# Altium schematic sheet pcbSchematic.SchDoc
size A; SheetNumber: 1; SheetTotal: 1
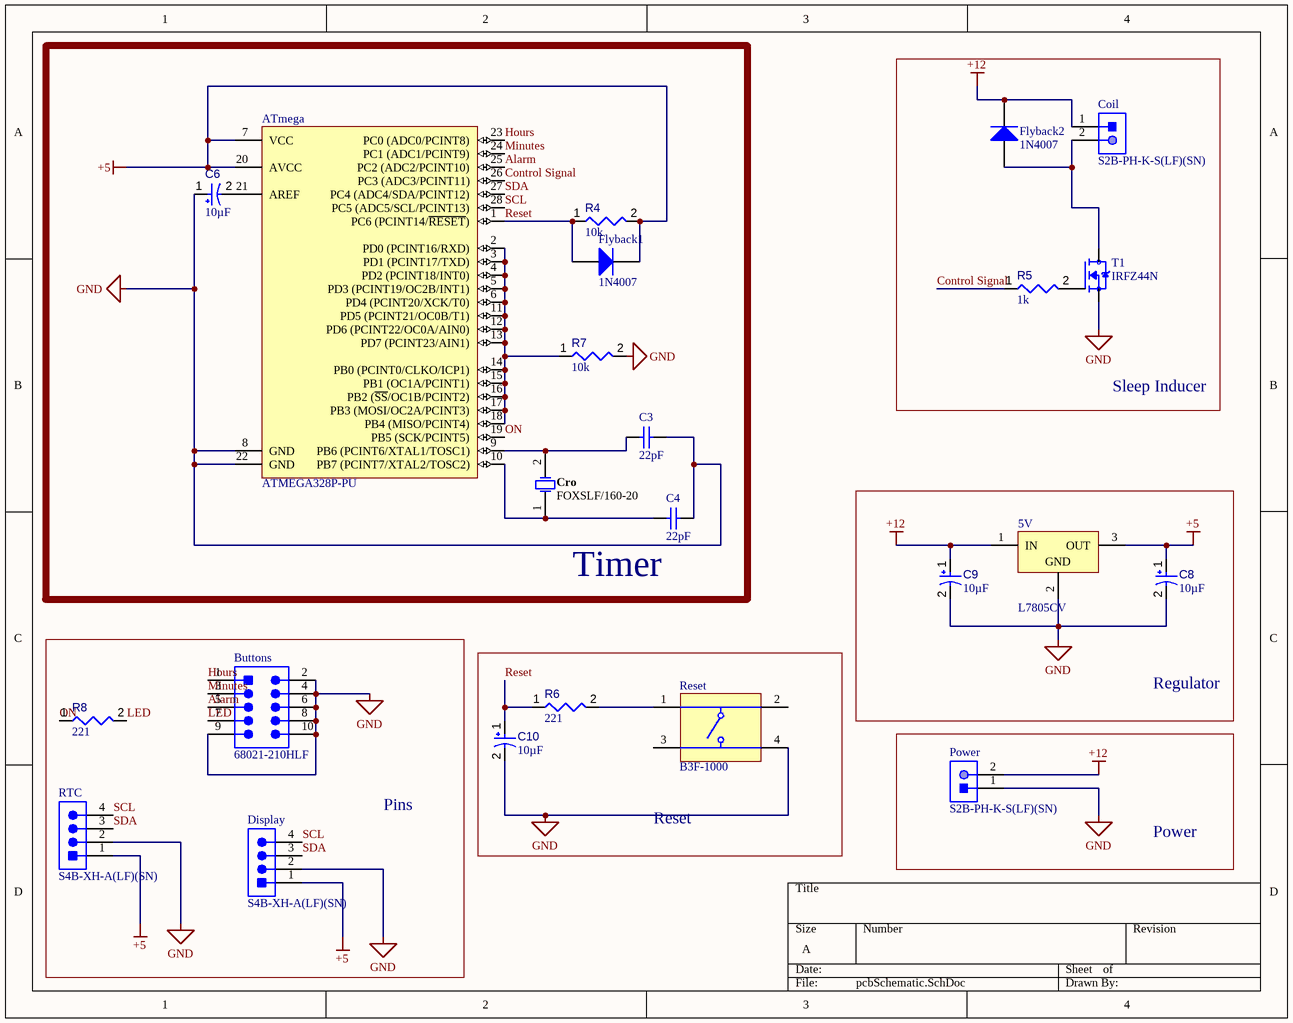
[diagram p0: pcbSchematic.SchDoc]

## Parts
5V  L7805CV  [TO220]
ATmega  ATMEGA328P-PU  [ATML-28P3]
Buttons  68021-210HLF  [FCI-68021-210HLF-10_V]
C3  22pF  [KEMT-C315-THT-2]
C4  22pF  [KEMT-C315-THT-2]
C6  value 10µF  [CAPPR55-200-1100X500X1200]  (hidden comment: ECA1HM100)
C8  value 10µF  [CAPPR55-200-1100X500X1200]  (hidden comment: ECA1HM100)
C9  value 10µF  [CAPPR55-200-1100X500X1200]  (hidden comment: ECA1HM100)
C10  value 10µF  [CAPPR55-200-1100X500X1200]  (hidden comment: ECA1HM100)
Coil  S2B-PH-K-S(LF)(SN)  [JST-S2B-PH-K-S_V]
Cro  FOXSLF/160-20  [FOX-FOXSLF160-20]
Display  S4B-XH-A(LF)(SN)  [JST-S4B-XH-A(LF)(SN)_V]
Flyback1  1N4007  [FAIR-DO-41-2]
Flyback2  1N4007  [FAIR-DO-41-2]
Power  S2B-PH-K-S(LF)(SN)  [JST-S2B-PH-K-S_V]
R4  value 10k  [RESA60-630X240]  (hidden comment: MFR-25FBF52-10K)
R5  value 1k  [RESA60-630X240]  (hidden comment: MFR-25FBF52-1K)
R6  value 221  [RESA60-630X240]  (hidden comment: MFR-25FBF52-221R)
R7  value 10k  [RESA60-630X240]  (hidden comment: MFR-25FBF52-10K)
R8  value 221  [RESA60-630X240]  (hidden comment: MFR-25FBF52-221R)
Reset  B3F-1000  [OMRON-B3F-1000-4_V]
RTC  S4B-XH-A(LF)(SN)  [JST-S4B-XH-A(LF)(SN)_V]
T1  IRFZ44N  [TO254P1016X419X2286-3]

## Blocks framed on the sheet
Timer: ATmega C3 C4 C6 Cro Flyback1 R4 R7
Sleep Inducer: Coil Flyback2 R5 T1
Regulator: 5V C8 C9
Pins: Buttons Display R8 RTC
Reset: C10 R6 Reset
Power: Power

## Nets
+5: 5V.3(OUT) ATmega.7(VCC) ATmega.20(AVCC) C8.1 Display.1 Flyback1.1(K) R4.2 RTC.1
+12: 5V.1(IN) C9.1 Coil.1 Flyback2.1(K) Power.2
GND: 5V.2(GND) ATmega.8(GND) ATmega.22(GND) Buttons.2 Buttons.4 Buttons.6 Buttons.8 Buttons.9 Buttons.10 C3.2 C4.2 C6.1 C8.2 C9.2 C10.2 Display.2 Power.1 R7.2 Reset.4 RTC.2 T1.3(S)
Alarm: ATmega.25(PC2_(ADC2/PCINT10)) Buttons.5
Control Signal: ATmega.26(PC3_(ADC3/PCINT11)) R5.1
Hours: ATmega.23(PC0_(ADC0/PCINT8)) Buttons.1
LED: Buttons.7 R8.2
Minutes: ATmega.24(PC1_(ADC1/PCINT9)) Buttons.3
ON: ATmega.19(PB5_(SCK/PCINT5)) R8.1
Reset: ATmega.1(PC6_(PCINT14/~{RESET})) C10.1 Flyback1.2(A) R4.1 R6.1
SCL: ATmega.28(PC5_(ADC5/SCL/PCINT13)) Display.4 RTC.4
SDA: ATmega.27(PC4_(ADC4/SDA/PCINT12)) Display.3 RTC.3
NetATmega_2: ATmega.2(PD0_(PCINT16/RXD)) ATmega.3(PD1_(PCINT17/TXD)) ATmega.4(PD2_(PCINT18/INT0)) ATmega.5(PD3_(PCINT19/OC2B/INT1)) ATmega.6(PD4_(PCINT20/XCK/T0)) ATmega.11(PD5_(PCINT21/OC0B/T1)) ATmega.12(PD6_(PCINT22/OC0A/AIN0)) ATmega.13(PD7_(PCINT23/AIN1)) ATmega.14(PB0_(PCINT0/CLKO/ICP1)) ATmega.15(PB1_(OC1A/PCINT1)) ATmega.16(PB2_(~{SS}/OC1B/PCINT2)) ATmega.17(PB3_(MOSI/OC2A/PCINT3)) ATmega.18(PB4_(MISO/PCINT4)) R7.1
NetATmega_9: ATmega.9(PB6_(PCINT6/XTAL1/TOSC1)) C3.1 Cro.2
NetATmega_10: ATmega.10(PB7_(PCINT7/XTAL2/TOSC2)) C4.1 Cro.1
NetATmega_21: ATmega.21(AREF) C6.2
NetCoil_2: Coil.2 Flyback2.2(A) T1.2(D)
NetR5_2: R5.2 T1.1(G)
NetR6_2: R6.2 Reset.1

Not connected (* = marked no-connect by the designer): Reset 2 3

## Library data of the parts
5V = CMP-019-00018-3: Positive Voltage Regulator IC, 1.5 A, 5 V, 0 to 125 degC, 3-Pin TO-220, RoHS, Tube; Manufacturer: STMicroelectronics; Max Input Voltage: 35V; Min Supply Voltage: 8V; Nominal Output Voltage: 5V; Outputs: 1; Output Current: 1.5A; Dropout Voltage: 2V; Max Supply Voltage: 20V; Min Input Voltage: 7V; Datasheet Version: Rev 30, 09/2012; Min Operating Temperature: 0°C; Manufacturer URL: http://www.st.com/; Pins: 3; Mounting Technology: TH; Output Voltage: 5V; RoHS Compliant: True; Max Ouput Current: 1.5A; Datasheet URL: https://datasheet.ciiva.com/15111/getdatasheetpartid-44136-15111027.pdf; Packaging: Rail/Tube; Max Operating Temperature: 125°C; Case/Package: TO-220; Package Quantity: 50
ATmega = CMP-020-00004-3: 8-Bit Microcontroller with 32 KBytes In-System Programmable Flash, 23 I/Os, -40 to 85 degC, 28-Pin PDIP (28P3), RoHS, Tube; Manufacturer: Atmel; I/Os: 23; Density: 32KB; Package Version: Rev. B, 09/2001; Max Clock Frequency: 20MHz; Interface: USART; Max Supply Voltage: 5.5V; Min Supply Voltage: 1.8V; Ethernet Channels: 0; RAM Size: 2KB; RoHS Compliant: True; Datasheet URL: http://www.atmel.com/images/Atmel-8271-8-bit-AVR-Microcontroller-ATmega48A-48PA-88A-88PA-168A-168PA-328-328P_datasheet_Complete.pdf; Packaging: Rail/Tube; Manufacturer URL: http://www.atmel.com/; Mounting Technology: TH; Package URL: http://www.atmel.com/images/Atmel-8271-8-bit-AVR-Microcontroller-ATmega48A-48PA-88A-88PA-168A-168PA-328-328P_datasheet_Complete.pdf; Datasheet Version: Rev. 8271J, 11/2015; Package Description: 28-Pin Plastic Dual Inline Package, Body 34.671 x 7.3025 mm, Pitch 2.54 mm; Package Quantity: 14; Min Operating Temperature: -40°C; Max Operating Temperature: 85°C; Case/Package: DIP; Pins: 28; Package Reference: 28P3
Buttons = CMP-002-00020-2: Male Header, Pitch 2.54 mm, 2 x 5 Position, Height 4.83 mm, Tail Length 3.05 mm, Bulk; Manufacturer: FCI Electronics; Datasheet URL: http://portal.fciconnect.com/Comergent//fci/drawing/68020.pdf; Case/Package: 68021-210HLF-10; Manufacturer URL: http://portal.fciconnect.com/; Connector Type: Header; Mounting Technology: TH; Datasheet Version: Rev. BM, 04/2015; Package Description: Male Header, Pitch 2.54 mm, 2 x 5 Position, Height 4.83 mm, Tail Length 3.05 mm; Gender: Male; RoHS Compliant: Unknown; Package Reference: 68021-210HLF-10
C3 C4 = CMP-1664-00008-1: Capacitor, Ceramic, 22 pF, +/-10 %, 100 V, -55 to 125 degC, 2-Pin THD, RoHS, Bulk; Max Input Voltage: 40 V; Min Input Voltage: 4.2 V; Output Current: 1.5 A; Output Voltage: 1.2 V; Outputs: 1; Case\Package: TO-220; RoHSCompliant: true; Min Operating Temperature: 0 degC; Max Operating Temperature: 125 degC; Package Quantity: 50; ComponentLink2URL: http://capacitoredge.kemet.com/capedge2/DataSheet/Datasheet-C315C220K1G5TA.pdf?pn=C315C220K1G5TA{BULK}; Radiation Hardening: No; Pins: 3; Length: 10.28 mm; ComponentLink1URL: http://www.kemet.com/; ComponentLink2Description: Datasheet; Height: 9.28 mm; REACH SVHC: No SVHC; ComponentLink1Description: Manufacturer URL; Max Ouput Current: 1.5 A; Weight: 0.08113 oz; Packaging: Rail/Tube; DatasheetVersion: Aug-16; Mount: Through Hole; PackageReference: C315-THT-2; Width: 4.82 mm; PackageDescription: 2-Pin Through Hole Device, Body 3.81 x 2.54 mm
C6 C8-C10 = CMP-001-00025-7: Aluminum Electrolytic Capacitor, 10 uF, +/- 20%, 50 V, -40 to 85 degC, 2-Pin THD, RoHS, Bulk; Manufacturer: Panasonic; Ripple Current (AC): 65mA; Voltage Rating: 50V; Mounting Technology: TH; RoHS Compliant: True; Capacitor Type: Electrolytic; Datasheet Version: Rev. 05, 10/2016; Min Operating Temperature: -40°C; Packaging: Bulk; Ripple Current: 65mA; Tolerance: 20%; Max Operating Temperature: 85°C; Datasheet URL: https://industrial.panasonic.com/cdbs/www-data/pdf/RDF0000/ABA0000C1218.pdf; Lead Pitch: 2mm; Pins: 2; Diameter: 5mm; Manufacturer URL: http://www.panasonic.com/; Package Reference: CAPPR55-200-1100X500X1200; Package Description: 2-Pin Radial Lead, Dia 5 mm, Height 12 mm; Case/Package: Radial; Package Quantity: 200
Coil Power = CMP-002-00030-2: Male Header, Pitch 2 mm, 1 x 2 Position, Height 4.8 mm, Tail Length 3.4 mm, -25 to 85 degC, RoHS, Bulk; Manufacturer: Japan Solderless Terminals; Package Reference: S2B-PH-K-S; Case/Package: S2B-PH-K-S; Datasheet URL: http://www.jst-mfg.com/product/pdf/eng/ePH.pdf; RoHS Compliant: Unknown; Datasheet Version: Dec-12; Gender: Male; Min Operating Temperature: -25°C; Max Operating Temperature: 85°C; Package Description: Male Header, Pitch 2 mm, 1 x 2 Position, Height 4.8 mm, Tail Length 3.4 mm; Connector Type: Header; Mounting Technology: SM
Cro = CMP-003-00027-2: Resistance Weld Thru-Hole Crystal, 16 MHz, +/- 30 ppm, 20 pF, -20 to 70 degC, 2-Pin THD, RoHS, Bulk; Manufacturer: FOX Electronics; Load Capacitance: 20pF; Resistance: 40Ohm; ESR: 40; Tolerance: 50ppm; Frequency Tolerance: 30ppm; Frequency: 16MHz; Datasheet URL: http://www.foxonline.com/pdfs/hc49slf.pdf; Packaging: Bulk; Min Operating Temperature: -20°C; Max Operating Temperature: 70°C; Mounting Technology: TH; RoHS Compliant: True; Datasheet Version: Mar-15; Manufacturer URL: http://www.foxonline.com/; Package Description: 2-Pin Through Hole Device, Body 11.35 x 4.65 mm; Pins: 2; Package Quantity: 100; Case/Package: FOXSLF160-20; Package Reference: FOXSLF160-20
Display RTC = CMP-002-00034-2: Male Header, Pitch 2.5 mm, 1 x 4 Position, Height 6.1 mm, Tail Length 3.4 mm, -25 to 85 degC, RoHS, Bulk; Manufacturer: JST; Manufacturer URL: http://www.jst.com/home2.html; RoHS Compliant: Unknown; Gender: Male; Min Operating Temperature: -25°C; Datasheet URL: http://www.jst-mfg.com/product/pdf/eng/eXH.pdf; Case/Package: S4B-XH-A(LF)(SN); Datasheet Version: May-16; Mounting Technology: TH; Package Reference: S4B-XH-A(LF)(SN); Max Operating Temperature: 85°C; Package Description: XH Series Disconnectable Crimp Style Connector, Pitch 2.5 mm, 1 x 4 Position, Height 6.1 mm, Tail Length 3.4 mm; Connector Type: Header
Flyback1 Flyback2 = CMP-004-00007-2: General Purpose Rectifier, 1.1 V, 1.0 A, -55 to 175 degC, 2-Pin DO-41, RoHS, Tape and Reel; Manufacturer: Fairchild; Peak Reverse Current: 5uA; Max Surge Current: 30A; Elements: 1; Forward Voltage: 1.1V; Package Version: Rev. 2, 09/2008; Forward Current: 1A; Package Quantity: 5000; Packaging: TapeandReel; Package URL: http://www.fairchildsemi.com/dwg/DO/DO41A.pdf; Manufacturer URL: https://www.fairchildsemi.com/; Package Reference: DO-41-2; Pins: 2; Min Operating Temperature: -55°C; Datasheet Version: Rev. 1.1.0, 11/2014; Max Operating Temperature: 175°C; RoHS Compliant: True; Case/Package: DO-41-2; Mounting Technology: TH; Package Description: 2-Pin Axial Lead, Dia 2.375 mm, Body Length 4.63 mm; Datasheet URL: https://www.fairchildsemi.com/datasheets/1N/1N4007.pdf
R4 R7 = CMP-009-00047-4: Axial Resistor, 10 KOhm, +/- 1%, 0.25 W, -55 to 155 degC, 2-Pin THD, RoHS, Bulk; Manufacturer: Yageo; Power: 250mW; Voltage Rating: 250V; Manufacturer URL: http://www.yageo.com/; Datasheet URL: http://www.yageo.com/documents/recent/Yageo%20LR_MFR_2013.pdf; Package Reference: MFR-25; Min Operating Temperature: -55°C; Mounting Technology: TH; Package Quantity: 200; Case/Package: Axial; Tolerance: 1%; RoHS Compliant: True; Datasheet Version: Apr-13; Packaging: Bulk; Max Operating Temperature: 155°C; Package Description: 2-Pin Axial Lead, Dia 2.4 mm, Body Length 6.3 mm
R5 = CMP-009-00048-4: Axial Resistor, 1 KOhm, +/- 1%, 250 mW, -55 to 155 degC, 2-Pin THD, RoHS, Bulk; Manufacturer: Yageo; Voltage Rating: 250V; Power: 250mW; Min Operating Temperature: -55°C; Max Operating Temperature: 155°C; Tolerance: 1%; Package Reference: MFR-25; Composition: CarbonFilm; Mounting Technology: TH; Packaging: Bulk; Case/Package: Axial; Datasheet URL: http://www.yageo.com/documents/recent/Yageo%20LR_MFR_2013.pdf; Package Quantity: 200; Manufacturer URL: http://www.yageo.com/; Package Description: 2-Pin Axial Lead, Dia 2.4 mm, Body Length 6.3 mm; Datasheet Version: Apr-13; RoHS Compliant: True
R6 R8 = CMP-009-00051-4: Axial Resistor, 221 Ohm, +/- 1%, 250 mW, -55 to 155 degC, 2-Pin THD, RoHS, Bulk; Manufacturer: Yageo; Power: 250mW; Voltage Rating: 250V; Package Quantity: 200; Manufacturer URL: http://www.yageo.com/; Case/Package: Axial; Package Reference: MFR-25; RoHS Compliant: True; Mounting Technology: TH; Datasheet URL: http://www.yageo.com/documents/recent/Yageo%20LR_MFR_2013.pdf; Packaging: Bulk; Package Description: 2-Pin Axial Lead, Dia 2.4 mm, Body Length 6.3 mm; Max Operating Temperature: 155°C; Tolerance: 1%; Datasheet Version: Apr-13; Min Operating Temperature: -55°C
Reset = CMP-011-00004-2: Tactile Switch, SPST-NO, 0.05 A, 24 V, -25 to 70 degC, 4-Pin THD, RoHS, Bulk; Manufacturer: Omron Electronic Components; Throw Configuration: SPST; Max Contact Resistance: 100mohm; Resistance: 0.1Ohm; Max Current Rating: 50mA; Voltage Rating: 24V; Operating Force: 100gf; Datasheet Version: Jan-15; Case/Package: B3F-1000; Packaging: Bulk; Package Description: 4-Pin Through Hole Device, Body 6 x 6 mm; Manufacturer URL: http://www.omron.com/; Package Reference: B3F-1000; Contact Plating: Gold; Contact Current Rating: 50mA; RoHS Compliant: True; Contact Material: Gold; Mounting Technology: TH; Max Operating Temperature: 70°C; Min Operating Temperature: -25°C; Package Quantity: 1500; Datasheet URL: http://www.omron.com/ecb/products/pdf/en-b3f.pdf; Voltage Rating (DC): 24V; Pins: 4; Current Rating: 50mA; Max Voltage Rating (DC): 24V
T1 = CMP-007-000000-1: N-Channel 55 V 49A (Tc) 94W (Tc) Through Hole TO-220AB; MF: Infineon Technologies; SnapEDA_Link: https://www.snapeda.com/parts/IRFZ44N/Infineon+Technologies/view-part/?ref=snap; Package: TO-220-3 Infineon; Check_prices: https://www.snapeda.com/parts/IRFZ44N/Infineon+Technologies/view-part/?ref=eda; MP: IRFZ44N; Source: IRFZ44N.SchLib; Design Item ID: IRFZ44N; Value: *; Availability: In Stock; Component Type: Standard; Pin Count: 3; Purchase-URL: https://pricing.snapeda.com/search/part/IRFZ44N/?ref=eda; Price: None